# EAGLE design 311_lora_es920_faboblocks_Rev020002 (EAGLE 9.6.2)
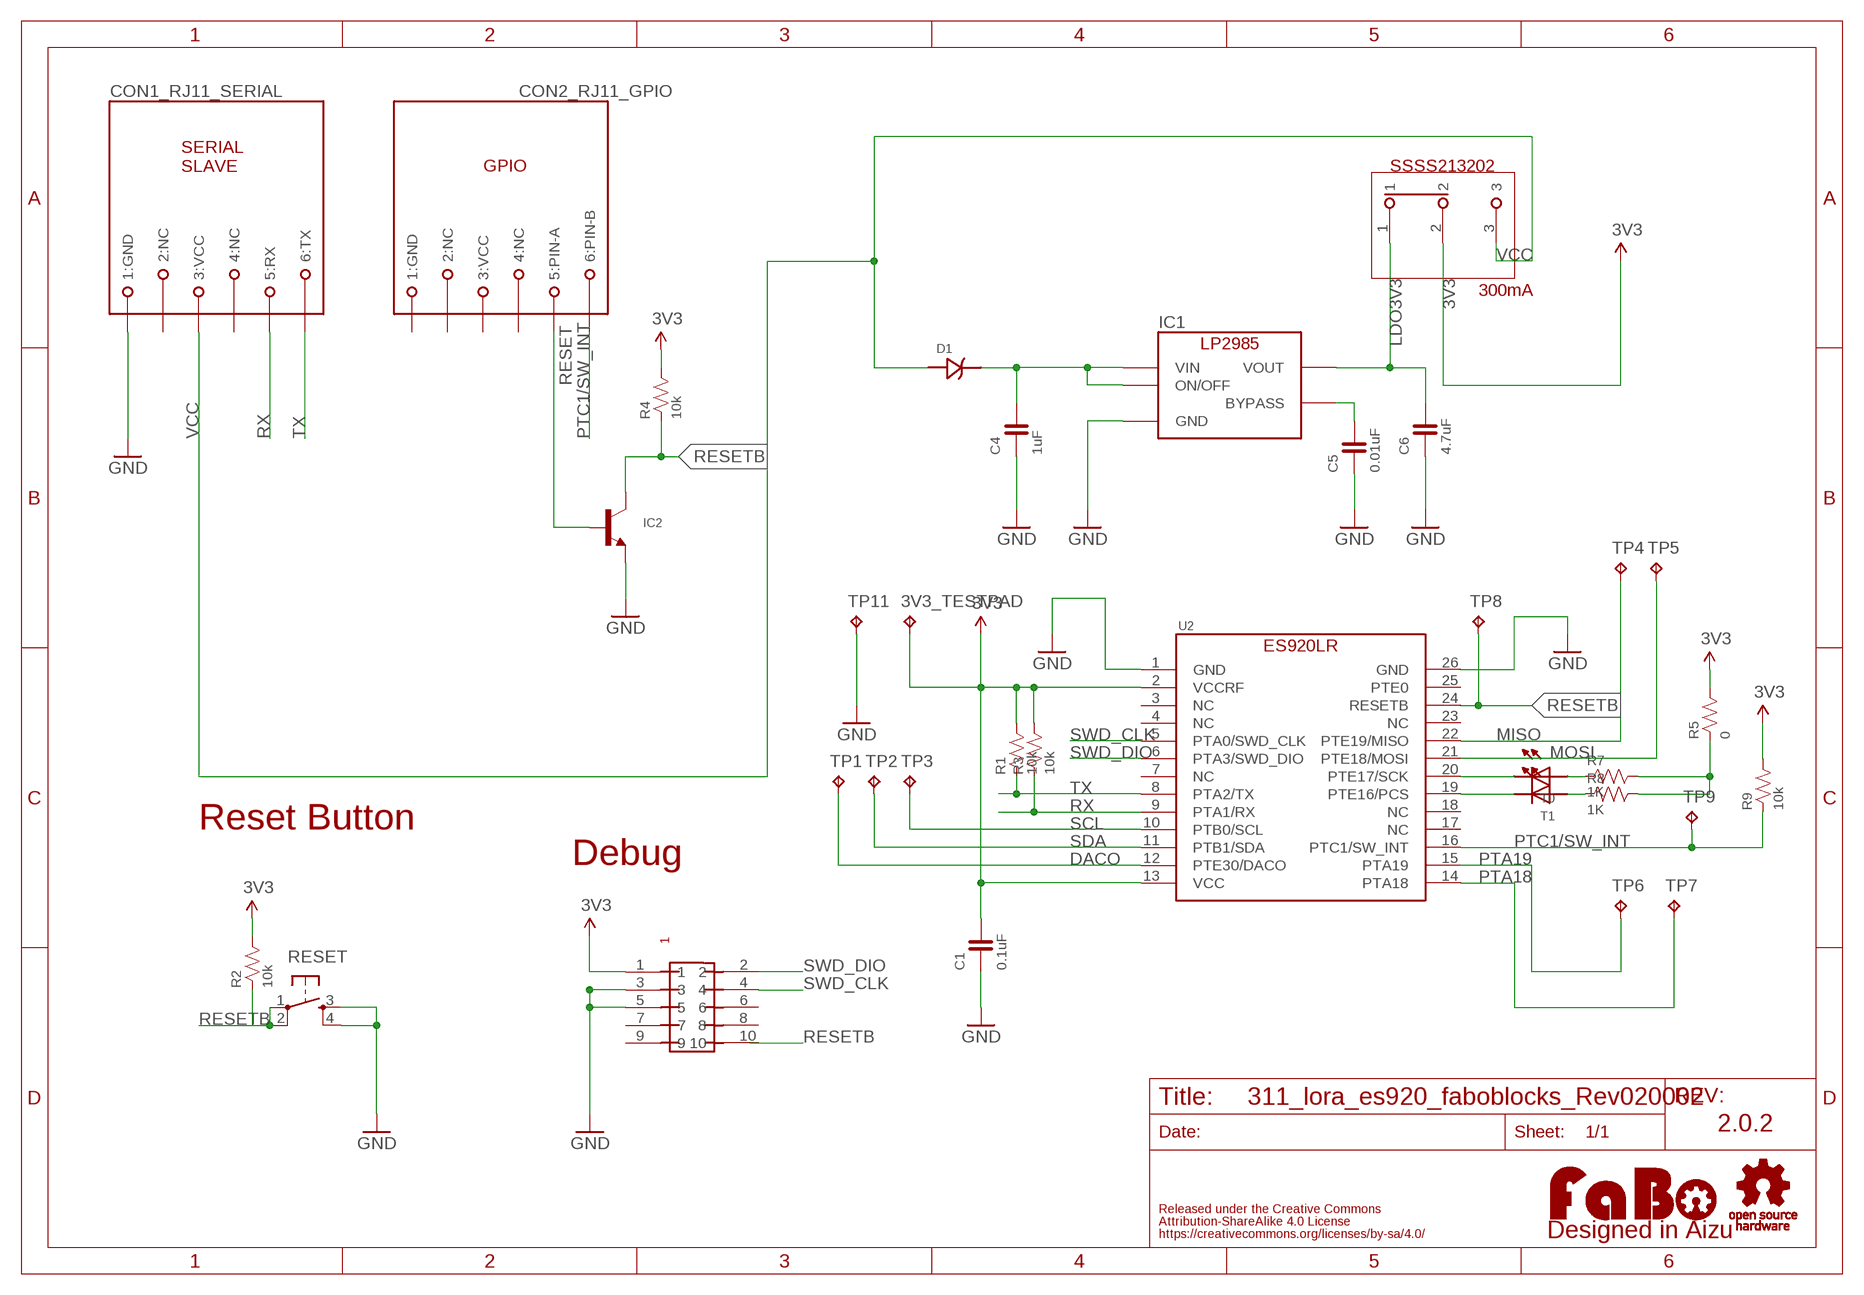
[diagram p0: schematic, sheet 1]

## Parts
3V3_TESTPAD  TPTP20R  [TP20R]
C1  0.1uF  CAPACITOR-0603_NARROW  [0603-NARROW]
C4  1uF  CAPACITOR-0603_NARROW  [0603-NARROW]
C5  0.01uF  CAPACITOR-0603_NARROW  [0603-NARROW]
C6  4.7uF  CAPACITOR-0603_NARROW  [0603-NARROW]
CON1_RJ11_SERIAL  MODULAR-JACK-6P-RJ11_SERIAL_S  [7002-6PXC-X]
CON2_RJ11_GPIO  MODULAR-JACK-6P-RJ11_GPIO  [7002-6PXC-X]
D1  CUS05F40  [CUS05F40]
IC1  LP2985-33DBV  [SOT-23-5]
IC2  NPN-SMD  [SOT23-3]
LOGO1  LOGO_FABO-M_BOTTOM  [LOGO_FABO_M_BOTTOM]
R1  10k  RESISTOR-0402  [0402]
R2  10k  RESISTOR-0402  [0402]
R3  10k  RESISTOR-0402  [0402]
R4  10k  RESISTOR-0402  [0402]
R5  0  RESISTOR-0402  [0402]
R7  1K  RESISTOR-0402  [0402]
R8  1K  RESISTOR-0402  [0402]
R9  10k  RESISTOR-0402  [0402]
RESET  TACT-SWITCH-SMD_KMR2  [KMR2]
T0  LED-0603  [0603]
T1  LED-0603  [0603]
TP1  TPTP20R  [TP20R]
TP2  TPB1,27  [B1,27]
TP3  TPTP20R  [TP20R]
TP4  TPTP20R  [TP20R]
TP5  TPTP20R  [TP20R]
TP6  TPTP20R  [TP20R]
TP7  TPTP20R  [TP20R]
TP8  TPTP20R  [TP20R]
TP9  TPTP20R  [TP20R]
TP11  TPTP20R  [TP20R]
U2  ES920LR_MODULE  [MODULE]
U$3  LOGO_OSHW-M_BOTTOM  [LOGO_OSHW_M_BOTTOM]
U$5  SSSS213202  [SSSS213202]
U$8  PIN-HEADER-SMT(1.27MM)2X5  [PIN-HEADER-SMT(1.27MM)2X5]

## Nets
3V3: 3V3_TESTPAD.TP C1.2 R1.2 R2.2 R3.2 R4.2 R5.2 R9.2 U2.2(VCCRF) U2.13(VCC) U$5.2 U$8.1
DACO: TP1.TP U2.12(PTE30/DACO)
GND: C1.1 C4.1 C5.1 C6.1 CON1_RJ11_SERIAL.1(1:GND) IC1.2(GND) IC2.2(E) RESET.3 RESET.4 TP11.TP U2.1(GND) U2.26(GND) U$8.3 U$8.5
LDO3V3: C6.2 IC1.5(VOUT) U$5.1
MISO: TP4.TP U2.22(PTE19/MISO)
MOSI: TP5.TP U2.21(PTE18/MOSI)
N$1: R5.1 R7.2 R8.2
N$3: T1.CATHODE U2.19(PTE16/PCS)
N$4: T0.CATHODE U2.20(PTE17/SCK)
N$5: R7.1 T0.ANODE
N$6: R8.1 T1.ANODE
N$9: C5.2 IC1.4(BYPASS)
N$17: C4.2 D1.C(CATHODE) IC1.1(VIN) IC1.3(ON/OFF)
PTA18: TP7.TP U2.14(PTA18)
PTA19: TP6.TP U2.15(PTA19)
PTC1/SW_INT: CON2_RJ11_GPIO.6(6:PIN-B) R9.1 TP9.TP U2.16(PTC1/SW_INT)
RESET: CON2_RJ11_GPIO.5(5:PIN-A) IC2.1(B)
RESETB: IC2.3(C) R2.1 R4.1 RESET.1 RESET.2 TP8.TP U2.24(RESETB) U$8.10
RX: CON1_RJ11_SERIAL.5(5:RX) R3.1 U2.9(PTA1/RX)
SCL: TP3.TP U2.10(PTB0/SCL)
SDA: TP2.TP U2.11(PTB1/SDA)
SWD_CLK: U2.5(PTA0/SWD_CLK) U$8.4
SWD_DIO: U2.6(PTA3/SWD_DIO) U$8.2
TX: CON1_RJ11_SERIAL.6(6:TX) R1.1 U2.8(PTA2/TX)
VCC: CON1_RJ11_SERIAL.3(3:VCC) D1.A(ANODE) U$5.3
Unconnected: CON1_RJ11_SERIAL.2(2:NC) CON1_RJ11_SERIAL.4(4:NC) CON2_RJ11_GPIO.2(2:NC) CON2_RJ11_GPIO.4(4:NC) U2.3(NC) U2.4(NC) U2.7(NC) U2.17(NC) U2.18(NC) U2.23(NC) U2.25(PTE0) U$8.6 U$8.7 U$8.8 U$8.9

## Notes on the sheet
- SSSS213202
- 300mA
- Reset Button
- Debug
- 2.0.2

## Power pins joined to a net without a drawn wire
1:GND: CON2_RJ11_GPIO.1(1:GND)
3:VCC: CON2_RJ11_GPIO.3(3:VCC)

## Library data of the parts
3V3_TESTPAD TP1-TP9 TP11 = testpad:TP: Test pad
C1 C4-C6 = FaBo-Capacitor:CAPACITOR: CAPACITOR
CON1_RJ11_SERIAL = FaBo-Connetor:MODULAR-JACK-6P-RJ11_SERIAL_S
CON2_RJ11_GPIO = FaBo-Connetor:MODULAR-JACK-6P-RJ11_GPIO
D1 = FaBo-Diode:CUS05F40
IC1 = FaBo-Supply:LP2985: LP2985
IC2 = FaBo-Transistor:NPN
LOGO1 = component:LOGO_FABO
R1-R5 R7-R9 = FaBo-Resistors:RESISTOR: RESISTOR
RESET = FaBo-Switch:TACT-SWITCH
T0 T1 = FaBo-LED:LED
U2 = FaBo-LoRa:ES920LR_MODULE
U$3 = component:LOGO_OSHW
U$5 = FaBo-Switch:SSSS213202
U$8 = GClue:PIN-HEADER-SMT(1.27MM)2X5: PIN-HEADER-SMT (1.27MM) 2x5

## Board
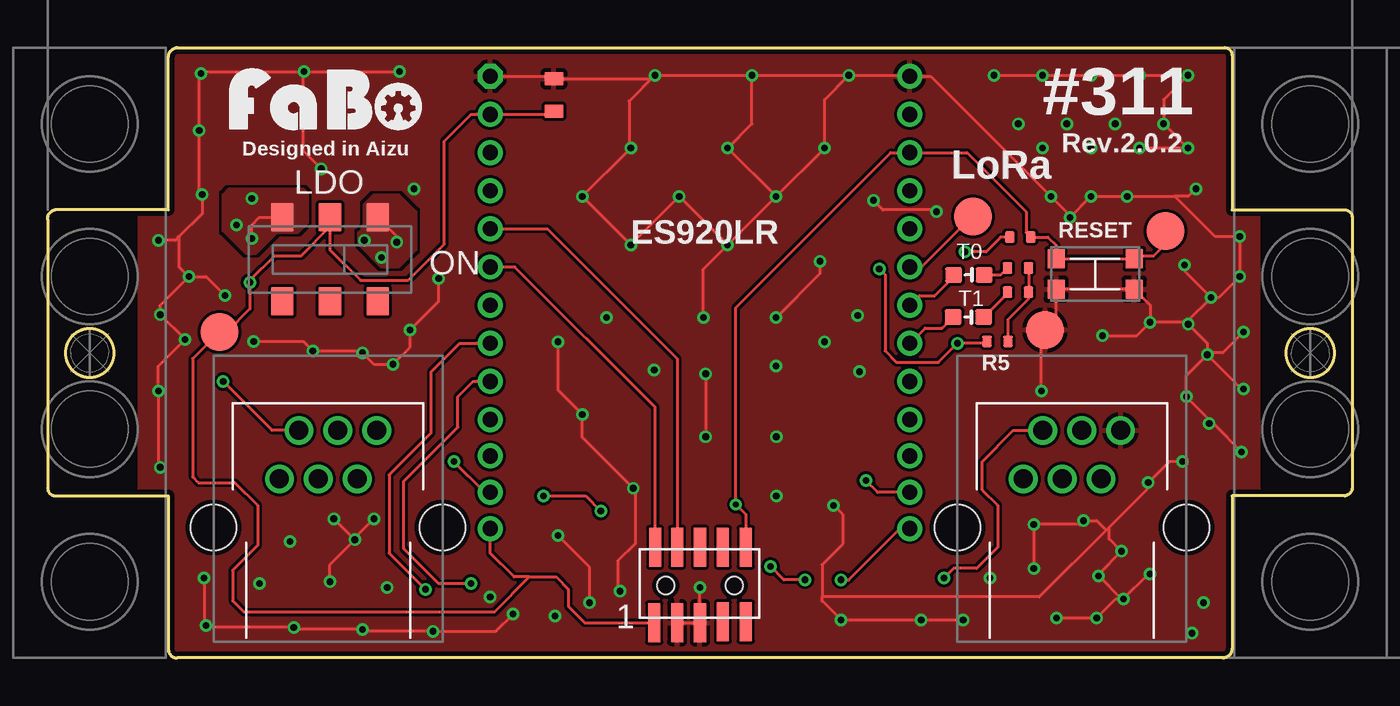
[diagram p1: board, top side]
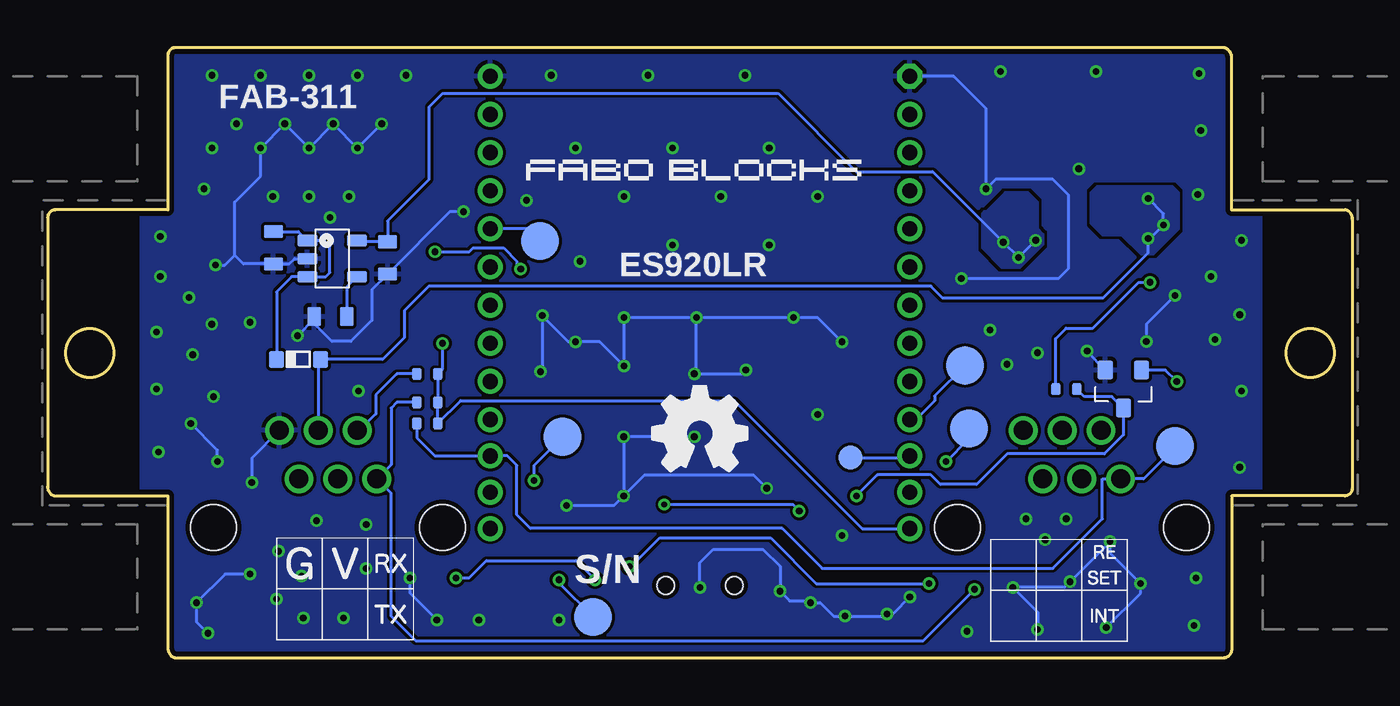
[diagram p2: board, bottom side, seen from below]

Size 68.41 x 32 mm. Coordinates in mm from the lower left corner, seen from the top.
Outline: 6.8,32 61.7,32 arc-90 62.1,31.6 62.1,23.5 68,23.5 arc-90 68.4,23.1 68.4,9 arc-90 68,8.5 62.1,8.5 62.1,0.5 arc-90 61.6,0 6.8,0 arc-90 6.33,0.4 6.33,8.5 0.4,8.5 arc-90 0,8.9 0,23 arc-90 0.4,23.5 6.33,23.5 6.33,31.5 arc-90 6.8,32
Outline: circle at 66.2,16 radius 1.27
Outline: circle at 2.2,16 radius 1.27
Copper layers (1*16): Top 0.035mm / dielectric 1.6mm / Bottom 0.035mm
Design rules "PCBway": minimum track width 6mil, minimum drill 12mil, track to track 6mil, track to pad 6mil, pad to pad 6mil, via to via 6mil, smd to smd 6mil, copper to edge 10mil, drill to drill 10mil, minimum pad ring 10mil, minimum via ring 6mil, stop-mask expansion 2mil, vias tented up to drill 100mil, thermal gap 8mil
tRestrict: area -1.2,7.3 to 4.7,24.4; area 63.6,7.5 to 69.5,24.6
bRestrict: area -1.2,7.3 to 4.7,24.4; area 63.6,7.6 to 69.5,24.7

### Footprints (pad centres in the part's own frame; a part is rotated, then mirrored left to right if it is on the bottom)
TP20R = smd 2 x 2: TP 0,0
0603-NARROW = smd 0.71 x 1: 1 -0.85,0; 2 0.85,0
7002-6PXC-X = drill 1: 1 2.55,5.08; 2 1.53,2.54; 3 0.51,5.08; 4 -0.51,2.54; 5 -1.53,5.08; 6 -2.55,2.54 | hole 2.4: -6,0; 6,0
CUS05F40 = smd 0.8 x 0.9: A -1.15,0; C 1.15,0
SOT-23-5 = smd 0.6 x 1.05: 1 -0.95,-1.3; 2 0,-1.3; 3 0.95,-1.3; 4 0.95,1.3; 5 -0.95,1.3
SOT23-3 = smd 0.8 x 1: 1 -0.95,-1; 2 0.95,-1; 3 0,1
0402 = smd 0.5 x 0.6: 1 -0.55,0; 2 0.55,0
KMR2 = smd 0.9 x 1: 1 -2.05,0.8; 2 2.05,0.8; 3 2.05,-0.8; 4 -2.05,-0.8
0603 = smd 0.9 x 0.8: ANODE -0.8,0; CATHODE 0.8,0
B1,27 = smd 1.27 x 1.27: TP 0,0
MODULE = drill 0.8 pad 1.27 octagon: 1 -11,9 | drill 0.8 pad 1.27: 2 -11,7; 3 -11,5; 4 -11,3; 5 -11,1; 6 -11,-1; 7 -11,-3; 8 -11,-5; 9 -11,-7; 10 -11,-9; 11 -11,-10.905; 12 -11,-12.81; 13 -11,-14.715; 14 11,-14.715; 15 11,-12.81; 16 11,-10.905; 17 11,-9; 18 11,-7; 19 11,-5; 20 11,-3; 21 11,-1; 22 11,1; 23 11,3; 24 11,5; 25 11,7; 26 11,9
SSSS213202 = smd 1.2 x 1.5: 1 -2.5,-2.2; 2 0,-2.2; 3 2.5,-2.2; 4 2.5,2.2; 5 0,2.2; 6 -2.5,2.2
PIN-HEADER-SMT(1.27MM)2X5 = smd 0.635 x 2.032: 1 -2.4,-1.95; 2 -2.35,2; 3 -1.2,-1.95; 4 -1.2,2; 5 0,-1.95; 6 0,2; 7 1.2,-1.9; 8 1.2,2; 9 2.4,-1.9; 10 2.4,2 | hole 0.9: 1.8,0; -1.8,0

### Placement (x,y rotation side)
3V3_TESTPAD  9,17.1 0 top
C1  26.54,29.52 270 top
C4  56.57,21.51 90 bottom
C5  53.57,17.9 0 bottom
C6  50.58,20.98 90 bottom
CON1_RJ11_SERIAL  53.7,6.85 0 top
CON2_RJ11_GPIO  14.7,6.85 0 top
D1  55.26,15.66 180 bottom
IC1  53.49,20.94 270 bottom
IC2  12,14.1 180 bottom
LOGO1  14.57,27.31 0 bottom
R1  48.5,13.4 0 bottom
R2  51,22.07 180 top
R3  48.5,14.9 0 bottom
R4  15,14.1 180 bottom
R5  49.8,16.6 180 top
R7  50.88,20.45 0 top
R8  50.88,19.19 0 top
R9  48.5,12.3 0 bottom
RESET  54.92,20.13 0 top
T0  48.3,20.09 180 top
T1  48.28,17.88 180 top
TP1  20.11,12.03 0 bottom
TP2  26.3,10.5 0 bottom
TP3  20.31,15.34 0 bottom
TP4  42.6,21.87 0 bottom
TP5  48.51,23.15 0 top
TP6  41.41,11.6 0 bottom
TP7  39.81,2.16 0 bottom
TP8  58.6,22.4 0 top
TP9  9.3,11.11 0 bottom
TP11  52.3,17.2 0 top
U2  34.2,21.5 0 top
U$2  [4-1BLOCK]  2.2,16 0 top
U$3  34.2,11.78 0 top
U$4  [4-1BLOCK]  66.2,16 180 top
U$5  14.8,20.9 180 top
U$8  34.2,3.8 0 top

### Tracks (layer width: path | path; a pad name or v marks a point on that pad's centre or on a via)
3V3  (via drill 0.35)
  Top 0.152: 25.25,4.25 23.4,2.4 10.3,2.4 9.7,3 9.7,4.6 11,5.9 11,8 9.8,9.2 7.9,9.2 7.6,9.5 7.6,15.7 3V3_TESTPAD.TP 9.4,17.1 10.6,18.3 v10.6,19.7 10.6,19.8 11.9,21.1 13.3,21.1 14.8,22.6 U$5.2 14.8,21.4 16.4,19.8 18.9,19.8 20.8,21.7 20.8,27.1 22.2,28.5 U2.2 26.38,28.5 C1.2 | 25.25,4.25 24.45,4.25 23.2,5.5 U2.13 | 25.25,4.25 26.65,4.25 27.3,3.6 27.3,2.7 28.15,1.85 U$8.1 | U$8.1 | R5.2 49.15,16.5 v47.7,16.5 46.7,15.5 44.5,15.5 43.9,16.1 43.9,20.1 v43.6,20.4 | R2.2 49.97,22.07 49.2,21.3 v48.1,21.3
  Bottom 0.152: v47.7,16.5 47.7,15.15 R3.2 R1.2 R9.2 46.75,13.5 32.4,13.5 25.69,6.79 U2.13 | v10.6,19.7 11.2,19.7 13.6,17.3 15,17.3 15.55,16.75 R4.2 | v48.1,21.3 46.3,21.3 46.1,21.5 44.5,21.5 43.8,20.8 43.8,20.6 v43.6,20.4
DACO  (via drill 0.35)
  Top 0.152: U2.12 22.91,8.69 v21.3,10.3
  Bottom 0.152: v21.3,10.3 20.11,11.5 TP1.TP
GND  (via drill 0.35)
  Top 0.152: 40.6,3.2 40.6,4.9 41.7,6 41.7,7.5 v41.2,8 | 40.6,3.2 52,3.2 55.5,6.7 | 55.65,6.85 55.5,6.7 | v24.4,2.3 23.5,1.4 v20.2,1.4 16.6,1.4 v16.5,1.5 13,1.5 v12.9,1.6 8.4,1.6 v8.3,1.7 8.2,1.8 v8.2,4.2 | v5.8,21.9 6.7,21.9 6.9,22.1 | 6.9,22.1 8.1,23.3 v8.1,24.3 7.94,24.46 v7.94,27.65 7.94,30.55 v8.04,30.65 8.14,30.75 13.4,30.75 | v7.4,20 6.9,20.5 6.9,22.1 | v7.4,20 5.9,18.5 v5.9,18 v7.2,16.7 5.8,15.3 v5.8,14 5.8,10.1 v5.9,10 | v7.4,20 8.3,20 v9.3,19 | v20.5,19.9 20.5,18.7 v19,17.2 19,16.3 v18.1,15.4 17.1,15.4 v16.5,16 16.4,16.1 v13.9,16.1 13.4,16.6 v10.8,16.6 | v14.8,4 14.8,4.9 v16.1,6.2 | v16.1,6.2 v15,7.3 | v16.1,6.2 16.1,6.3 v17.1,7.3 | v61,18.9 61.4,18.9 v62.5,20 v62.5,22.1 61.2,22.1 59.1,24.2 | v61,18.9 59.6,20.3 v59.6,20.6 | v59.8,17.5 59.8,17.7 v61,18.9 | v59.8,17.5 59.7,17.6 v57.8,17.6 | v59.8,17.5 60.8,16.5 60.8,16 | 60.8,16 v60.8,15.9 | v62.7,17.1 61.6,16 60.8,16 | v60.8,15.9 62.6,14.1 v62.7,14.1 | v60.8,15.9 59.7,14.8 v59.7,13.7 60.9,12.5 v60.9,12.3 61.1,12.3 v62.6,10.8 | v59.5,10.3 58.8,10.3 v57.7,9.2 57.7,8.9 55.65,6.85 | v56.4,3.1 56.3,3.1 v55.1,4.3 55.1,4.4 v56.3,5.6 55.65,6.25 55.65,6.85 | v56.4,3.1 57.7,4.4 v57.8,4.4 | 55.5,6.7 55,7.2 v54.3,7.2 54.1,7 v51.7,7 v51.7,4.7 | 59.1,24.2 v56.6,24.2 v54.7,24.2 v53.6,23.1 53.6,23.2 v52.6,24.2 46.3,30.5 U2.26 45.15,30.55 v42,30.55 | v60.2,24.6 59.8,24.2 59.1,24.2 | v57.8,17.6 57.8,18.51 RESET.3 RESET.4 52.87,17.77 TP11.TP 52.1,17 v52.1,14 | 40.6,3.2 40.6,3 v41.6,2 v45.8,2 v48,2 | v52.9,2.1 v55,2.1 56,3.1 v56.4,3.1 | U$8.3 34.05,1.85 34.1,1.8 34.1,1.95 U$8.5 v34.2,3.7 | v30,3.5 29.9,3.6 29.9,5.1 30.8,6 30.8,8.8 v30.7,8.9 28.03,11.57 v28.03,12.77 26.76,14.04 v26.76,16.58
  Top 0.152: v55.3,16.9 57.1,16.9 v57.8,17.6 | v49.62,30.55 v52.16,30.55 v54.7,30.55 v57.24,30.55 v59.78,30.55 58.51,29.28 v58.51,28.01 v59.78,26.74 v57.24,26.74 | v26.76,6.42 28.4,4.78 v28.4,2.9 | v34.38,17.85 34.38,20.39 v35.65,21.66 | v35.65,21.66 v33.11,24.2 v30.57,21.66 v28.03,24.2 30.49,26.66 | 30.49,26.66 v30.57,26.74 | v38.19,24.2 v35.65,26.74 36.92,28.01 36.92,30.48 | v38.19,24.2 v35.65,21.66 | v38.19,24.2 v40.73,26.74 40.73,29.28 v42,30.55 | 36.92,30.48 v36.92,30.55 | v31.84,30.55 30.49,29.2 30.49,26.66 | v31.84,30.55 36.85,30.55 | 36.85,30.55 36.92,30.48 | 36.85,30.55 v42,30.55 | v46.6,23.4 46.5,23.5 43.79,23.5 v43.29,24 | v40.49,20.8 40.49,20.15 v38.19,17.85 | 13.4,30.75 v13.44,30.75 v18.44,30.75 | v14.34,25.65 13.4,26.59 13.4,30.75 | v34.5,14.9 v34.5,11.6 | U2.1 26.41,30.5 C1.1 31.66,30.37 v31.84,30.55
  Bottom 0.152: IC1.2 55.46,20.94 55.74,20.66 C4.1 58.14,20.66 58.6,21.12 | 58.6,21.12 58.6,23.9 57.24,25.26 v57.24,26.74 v55.97,28.01 v54.7,26.74 v53.43,28.01 v52.16,26.74 v50.89,28.01 | v46.6,23.4 47.31,23.4 C6.1 51.4,19.31 51.4,17.7 52.5,16.6 53.5,16.6 54.56,17.66 54.56,17.76 C5.1 54.42,17.78 v55.3,16.9 | v9.3,19 10.8,17.5 v10.8,16.6 | v20.5,19.9 15.4,19.9 14.9,20.4 14.9,24.3 15.7,25.1 18.7,25.1 v19.2,24.6 19.2,28.8 20.9,30.5 U2.1 | v12.9,1.6 11.1,3.4 v11.1,3.9 12.7,5.5 v12.7,6.1 v14.8,4 15.1,3.7 v17.8,3.7 16.5,2.4 v16.5,1.5 | v57.8,4.4 59.1,4.4 v60.6,2.9 60.6,1.9 v60,1.3 | v59.5,10.3 59.5,10.9 v60.9,12.3 | v23.2,3.2 24.1,2.3 v24.4,2.3 24.5,2.2 v26.6,2.2 27.2,2.2 27.9,2.9 v28.4,2.9 28.5,3 29.5,3 v30,3.5 30,4.8 30.9,5.7 33.5,5.7 34.2,5 v34.2,3.7 | v48,2 49.4,3.4 v49.4,4.2 | IC2.2 13.9,16.05 v13.9,16.1 | 38.15,8.55 v38.2,8.5 38.7,8 v41.2,8 | 38.15,8.55 37.1,9.6 31.4,9.6 v30.7,8.9 | CON1_RJ11_SERIAL.1 57.7,10.48 v57.7,9.2 | v59.6,20.6 59.12,20.6 58.6,21.12 | v26.76,16.58 28.03,17.85 v29.3,17.85 v34.38,17.85 34.4,17.85 | 34.4,17.85 v38.19,17.85 v38.19,15.31 39.46,16.58 v40.73,16.58 41.1,16.58 v42.47,17.95 42.47,15.11 v42.57,15.01 | v31.8,15.1 32,14.9 v34.5,14.9 34.4,15 34.4,17.85 | v34.5,11.6 v38.2,11.6 38.2,8.6 38.15,8.55
  pour Bottom (rank 6): -12.1,-5.1 96.3,-5.1 96.3,40 -12.1,40
  pour Top (rank 6): -9.2,-2.7 88.3,-2.7 88.3,37.3 -9.2,37.3
LDO3V3  (via drill 0.35)
  Top 0.152: U$5.1 18.3,22.1 v18.3,21.8
  Bottom 0.152: v16.6,21.9 v17.5,21 v18.3,21.8 22,25.5 26,25.5 30.1,29.6 47.7,29.6 48.4,28.9 48.4,25.1 49.1,24.4 49.15,24.35 50.58,22.92 C6.2 52.13,21.83 IC1.5
  pour Top (no thermals): 17.5,20.5 16.3,21.7 16.3,22.3 16.6,22.6 16.6,23.8 17.1,24.3 18.4,24.3 19.3,23.4 19.3,21.4 18.4,20.5
  pour Bottom (no thermals): 16.2,21.7 16.2,22.2 16.5,22.5 16.5,23.9 17,24.4 18.2,24.4 19.2,23.4 19.3,23.4 19.4,23.3 19.4,21.5 18.4,20.5 17.4,20.5
MISO
  Bottom 0.152: TP4.TP 43.23,22.5 U2.22
MOSI
  Top 0.152: U2.21 45.8,20.5 48.45,23.15 TP5.TP
N$1
  Top 0.152: R7.2 R8.2 51.43,18.83 50.35,17.75 R5.1
N$3
  Top 0.152: U2.19 46,17.3 46.9,17.3 T1.CATHODE
N$4
  Top 0.152: U2.20 45.7,19 46.5,19 47.5,20 T0.CATHODE
N$5
  Top 0.152: T0.ANODE 49.96,20.09 R7.1
N$6
  Top 0.152: T1.ANODE 50.33,19.13 R8.1
N$9
  Bottom 0.152: IC1.4 52.72,19.46 C5.2
N$17
  Bottom 0.152: D1.C 56.41,19.2 55.61,19.99 IC1.3 53.81,19.99 53.6,20.2 53.6,21.6 53.89,21.89 IC1.1 55.26,22.36 C4.2
PTA18  (via drill 0.35)
  Top 0.152: v41.6,4.1 42,4.1 44.69,6.79 U2.14
  Bottom 0.152: v41.6,4.1 41.6,3.95 TP7.TP
PTA19  (via drill 0.35)
  Top 0.152: U2.15 43.51,8.69 v42.9,9.3
  Bottom 0.152: v42.9,9.3 42.9,10.11 TP6.TP
PTC1/SW_INT
  Bottom 0.152: TP9.TP 9.3,11.03 10.94,9.39 CON2_RJ11_GPIO.6 13.1,9.39 13.1,7.3 15.7,4.7 27.8,4.7 29.9,6.8 43.1,6.8 43.8,7.5 43.8,10.1 44.3,10.6 U2.16 48.1,10.6 49.05,11.55 R9.1
RESET  (via drill 0.35)
  Top 0.152: CON2_RJ11_GPIO.5 11.77,11.93 v9.2,14.5
  Bottom 0.152: v9.2,14.5 9.8,15.1 IC2.1
RESETB  (via drill 0.3, 0.35)
  Top 0.152: U$8.10 36.6,7.53 v36.08,8.05 36.08,18.38 44.2,26.5 U2.24 48.2,26.5 51.3,23.4 51.3,22.31 R2.1 52.44,22.07 52.87,21.63 RESET.1 RESET.2 57.14,21.1 58,21.1 58.6,21.7 TP8.TP | v26,8.5 28.2,8.5 v29,7.7
  Bottom 0.152: v36.08,8.05 29.35,8.05 v29,7.7 | R4.1 14.05,13.7 12.6,13.7 IC2.3 12,11.7 13,10.7 18.1,10.7 19.7,9.1 21.6,9.1 22.1,9.6 24.9,9.6 v26,8.5
RX  (via drill 0.35)
  Top 0.152: v47,4.2 47.5,4.7 48.7,4.7 49.8,5.8 49.8,8 49,8.8 49,10.3 50.63,11.93 CON1_RJ11_SERIAL.5 | v39.7,4.1 38.6,4.1 v37.9,4.8 | v22.2,3.9 20.5,3.9 18.67,5.73 18.67,9.27 21.5,12.1 21.5,13.7 22.3,14.5 U2.9
  Bottom 0.152: v47,4.2 46.3,4.2 45.4,5.1 40.7,5.1 v39.7,4.1 | v37.9,4.8 37.8,4.8 36.3,6.3 30.5,6.3 28.1,3.9 v22.2,3.9 | R3.1 50.1,14.9 51.2,13.8 51.2,12.8 52.07,11.93 CON1_RJ11_SERIAL.5
SCL
  Bottom 0.152: TP3.TP 21.9,13.74 21.9,13.5 22.9,12.5 U2.10
SDA
  Bottom 0.152: TP2.TP 23.3,10.5 U2.11
SWD_CLK
  Top 0.152: U2.5 26.2,22.5 33,15.7 U$8.4
SWD_DIO
  Top 0.152: U$8.2 31.85,13.15 24.5,20.5 U2.6
TX  (via drill 0.35)
  Top 0.152: v19.8,3.6 17.9,5.5 17.9,9.6 20.1,11.8 20.1,15 21.6,16.5 U2.8
  Bottom 0.152: v19.8,3.6 22.5,0.9 49.1,0.9 50.4,2.2 50.4,8.64 CON1_RJ11_SERIAL.6 50.4,10.14 50.4,13.1 50.1,13.4 R1.1
VCC  (via drill 0.35)
  Top 0.152: v10.7,22 10.7,22.7 11.1,23.1 U$5.3
  Bottom 0.152: v10.7,24.1 9.9,23.3 v9.9,22.7 10.6,22 v10.7,22 10.7,21.25 13.08,18.88 21.48,18.88 22.1,19.5 48.41,19.5 49.7,18.21 49.7,16.8 50.84,15.66 D1.A 54.21,15.56 CON1_RJ11_SERIAL.3
  pour Top (no thermals): 9.2,22.4 9.2,24.3 9.5,24.6 13.4,24.6 13.6,24.4 13.6,22.8 13.1,22.3 12,22.3 10.9,21.2 10.4,21.2
  pour Bottom (no thermals): 9.1,22.5 9.1,24.4 9.4,24.7 13.4,24.7 13.7,24.4 13.7,22.8 13.1,22.2 12.1,22.2 11.1,21.2 10.4,21.2

### Text on the board
tPlace: #311 | Rev.2.0.2 | Designed in Aizu | LDO | LoRa | ES920LR | ON
bPlace: FAB-311 | ES920LR | S/N
Document: LoRa #311 ES920 FaBo BLOKS Rev2.0.2 / 2022/08/18 ID2